# Altium schematic sheet TEENSY 2.1.SchDoc
size A4; SheetNumber: 1; SheetTotal: 1
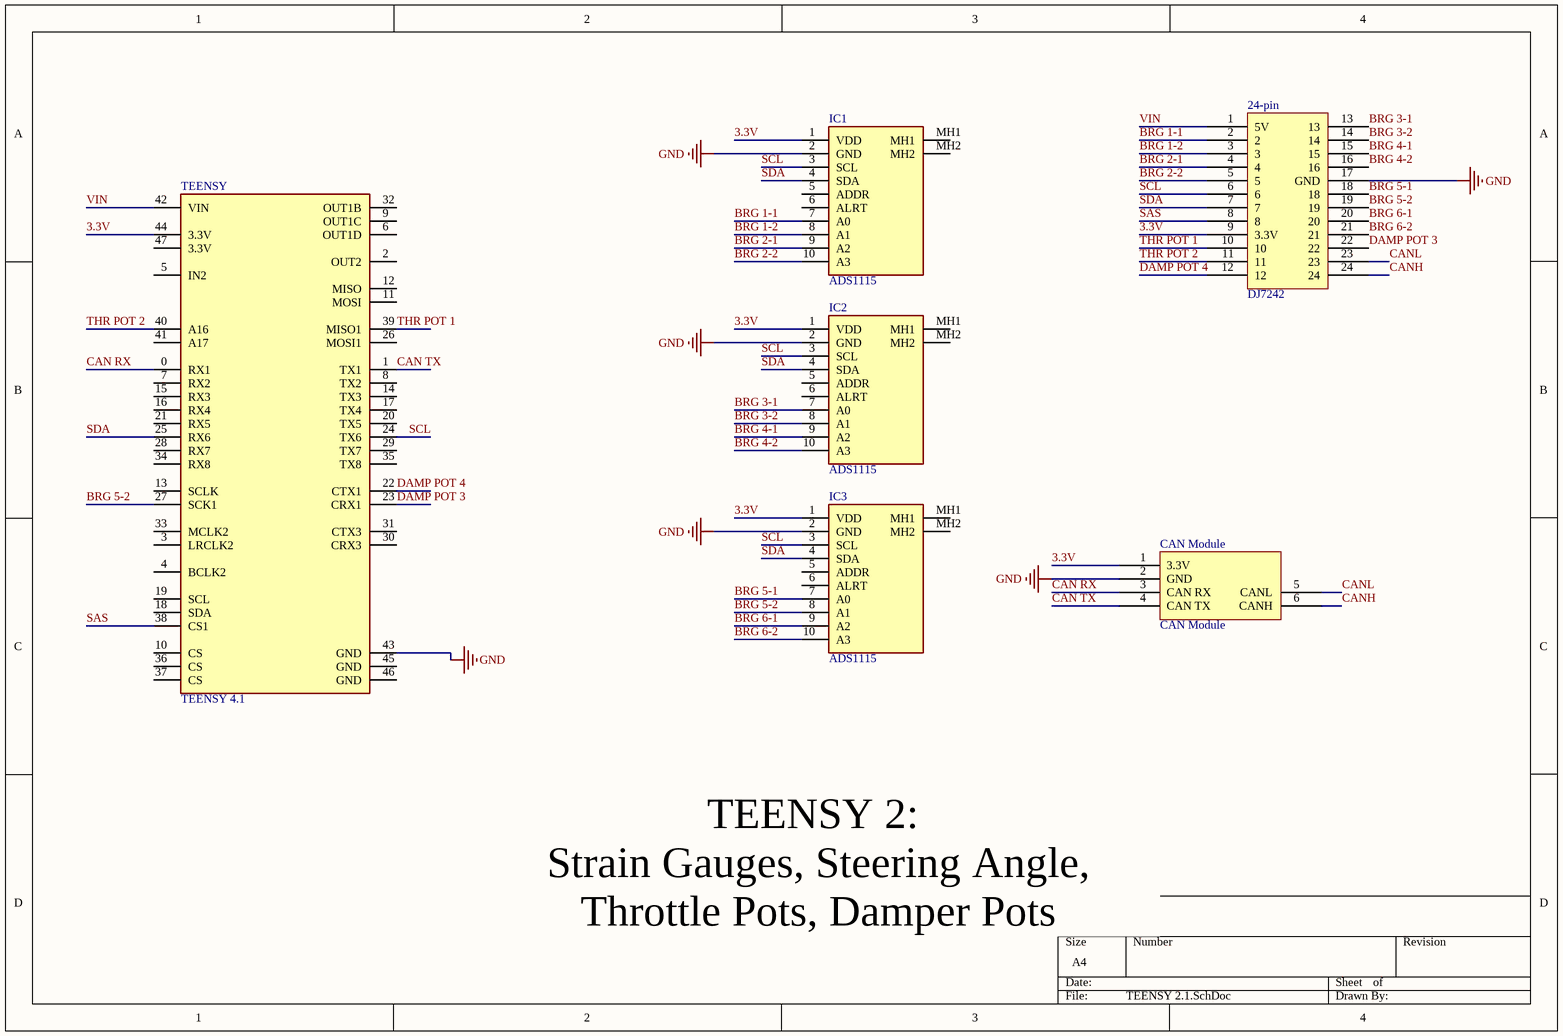
[diagram p0: TEENSY 2.1.SchDoc]

## Parts
24-pin  DJ7242  [DJ7242-Footprint-1]
CAN_Module  CAN Module  [CAN Module-Footprint-1]
IC1  ADS1115  [ADS1115]
IC2  ADS1115  [ADS1115]
IC3  ADS1115  [ADS1115]
TEENSY  TEENSY 4.1  [FP-DEV-16996-MFG]

## Nets
GND: 24-pin.17(GND) CAN_Module.2(GND) IC1.2(GND) IC2.2(GND) IC3.2(GND) TEENSY.43(GND)
3.3V: 24-pin.9(3.3V) CAN_Module.1(3.3V) IC1.1(VDD) IC2.1(VDD) IC3.1(VDD) TEENSY.44(3.3V)
BRG 1-1: 24-pin.2 IC1.7(A0)
BRG 1-2: 24-pin.3 IC1.8(A1)
BRG 2-1: 24-pin.4 IC1.9(A2)
BRG 2-2: 24-pin.5 IC1.10(A3)
BRG 3-1: 24-pin.13 IC2.7(A0)
BRG 3-2: 24-pin.14 IC2.8(A1)
BRG 4-1: 24-pin.15 IC2.9(A2)
BRG 4-2: 24-pin.16 IC2.10(A3)
BRG 5-1: 24-pin.18 IC3.7(A0)
BRG 5-2: 24-pin.19 IC3.8(A1) TEENSY.27(SCK1)
BRG 6-1: 24-pin.20 IC3.9(A2)
BRG 6-2: 24-pin.21 IC3.10(A3)
CAN RX: CAN_Module.3(CAN_RX) TEENSY.0(RX1)
CAN TX: CAN_Module.4(CAN_TX) TEENSY.1(TX1)
CANH: 24-pin.24 CAN_Module.6(CANH)
CANL: 24-pin.23 CAN_Module.5(CANL)
DAMP POT 3: 24-pin.22 TEENSY.23(CRX1)
DAMP POT 4: 24-pin.12 TEENSY.22(CTX1)
SAS: 24-pin.8 TEENSY.38(CS1)
SCL: 24-pin.6 IC1.3(SCL) IC2.3(SCL) IC3.3(SCL) TEENSY.24(TX6)
SDA: 24-pin.7 IC1.4(SDA) IC2.4(SDA) IC3.4(SDA) TEENSY.25(RX6)
THR POT 1: 24-pin.10 TEENSY.39(MISO1)
THR POT 2: 24-pin.11 TEENSY.40(A16)
VIN: 24-pin.1(5V) TEENSY.42(VIN)

Not connected (* = marked no-connect by the designer): IC1 5(ADDR) 6(ALRT) MH1 MH2; IC2 5(ADDR) 6(ALRT) MH1 MH2; IC3 5(ADDR) 6(ALRT) MH1 MH2; TEENSY 2(OUT2) 3(LRCLK2) 4(BCLK2) 5(IN2) 6(OUT1D) 7(RX2) 8(TX2) 9(OUT1C) 10(CS) 11(MOSI) 12(MISO) 13(SCLK) 14(TX3) 15(RX3) 16(RX4) 17(TX4) 18(SDA) 19(SCL) 20(TX5) 21(RX5) 26(MOSI1) 28(RX7) 29(TX7) 30(CRX3) 31(CTX3) 32(OUT1B) 33(MCLK2) 34(RX8) 35(TX8) 36(CS) 37(CS) 41(A17) 45(GND) 46(GND) 47(3.3V)

## Notes on the sheet
- TEENSY 2:
  Strain Gauges, Steering Angle,  Throttle Pots, Damper Pots

## Library data of the parts
24-pin = CMP-00030-00002-4: 24-pin connector
CAN_Module = CMP-00030-00003-1: CAN waveshare
IC1-IC3 = ADS1115: Integrated Circuit; Manufacturer_Name: Adafruit; Datasheet Link: https://cdn-learn.adafruit.com/downloads/pdf/adafruit-4-channel-adc-breakouts.pdf; Height: 3.25mm; Manufacturer_Part_Number: ADS1115
TEENSY = CMP-157412-000001-1: TEENSY 4.1 (HEADERS)